# EAGLE design Pipe_flow_header_v3 (EAGLE 8.5.2)
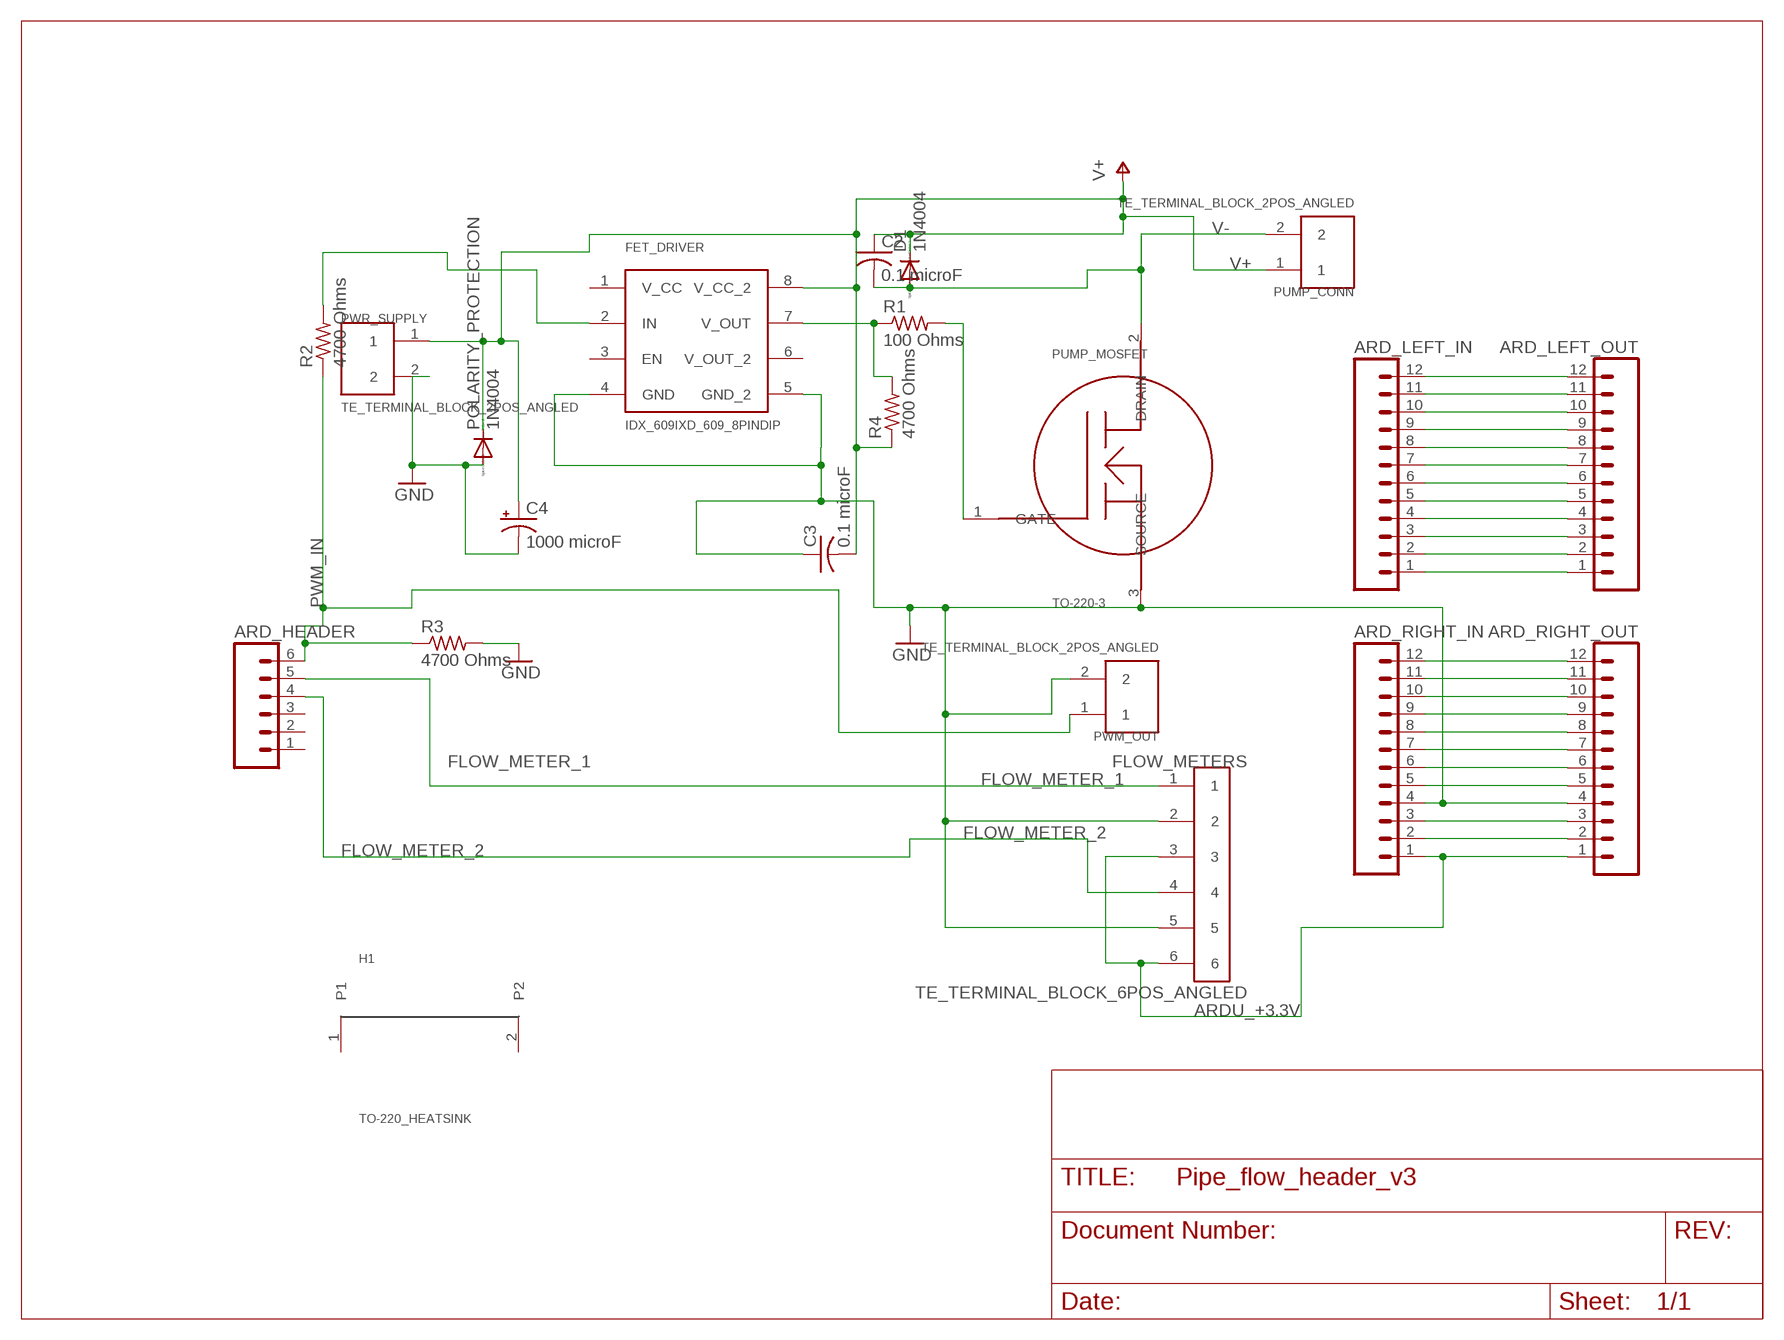
[diagram p0: schematic, sheet 1]

## Parts
ARD_HEADER  M06LONGPADS  [1X06_LONGPADS]
ARD_LEFT_IN  M12LOCK_LONGPADS  [1X12_LOCK_LONGPADS]
ARD_LEFT_OUT  M12LOCK_LONGPADS  [1X12_LOCK_LONGPADS]
ARD_RIGHT_IN  M12LOCK_LONGPADS  [1X12_LOCK_LONGPADS]
ARD_RIGHT_OUT  M12LOCK_LONGPADS  [1X12_LOCK_LONGPADS]
C2  0.1 microF  C-US075-032X103  [C075-032X103]
C3  0.1 microF  C-US075-032X103  [C075-032X103]
C4  1000 microF  CPOL-USE7.5-16  [E7,5-16]
D1  1N4004  [DO41-10]
FET_DRIVER  IDX_609IXD_609_8PINDIP  [IDX_609_8PINDIP]
FLOW_METERS  TE_TERMINAL_BLOCK_6POS_ANGLED  [TE_TERMINAL_BLOCK_6POS_ANGLED]
H1  TO-220_HEATSINK  [TO-220_HEATSINK]
POLARITY_PROTECTION  1N4004  [DO41-10]
PUMP_CONN  TE_TERMINAL_BLOCK_2POS_ANGLED  [TE_TERMINAL_BLOCK_2POS_ANGLED]
PUMP_MOSFET  TO-220-3  [TO-220-3]
PWM_OUT  TE_TERMINAL_BLOCK_2POS_ANGLED  [TE_TERMINAL_BLOCK_2POS_ANGLED]
PWR_SUPPLY  TE_TERMINAL_BLOCK_2POS_ANGLED  [TE_TERMINAL_BLOCK_2POS_ANGLED]
R1  100 Ohms  R-US_0204/7  [0204/7]
R2  4700 Ohms  R-US_0204/7  [0204/7]
R3  4700 Ohms  R-US_0204/7  [0204/7]
R4  4700 Ohms  R-US_0204/7  [0204/7]

## Nets
ARDU_+3.3V: ARD_RIGHT_IN.1 ARD_RIGHT_OUT.1 FLOW_METERS.3 FLOW_METERS.6
FLOW_METER_1: ARD_HEADER.5 FLOW_METERS.1
FLOW_METER_2: ARD_HEADER.4 FLOW_METERS.4
GATE: PUMP_MOSFET.1(GATE) R1.2
GND: ARD_RIGHT_IN.4 ARD_RIGHT_OUT.4 C3.1 C4.- FET_DRIVER.4(GND) FET_DRIVER.5(GND_2) FLOW_METERS.2 FLOW_METERS.5 POLARITY_PROTECTION.A PUMP_MOSFET.3(SOURCE) PWM_OUT.2 PWR_SUPPLY.2 R3.2
N$1: ARD_LEFT_IN.1 ARD_LEFT_OUT.1
N$2: ARD_LEFT_IN.2 ARD_LEFT_OUT.2
N$3: ARD_LEFT_IN.3 ARD_LEFT_OUT.3
N$4: ARD_LEFT_IN.12 ARD_LEFT_OUT.12
N$5: ARD_LEFT_IN.4 ARD_LEFT_OUT.4
N$6: ARD_LEFT_IN.5 ARD_LEFT_OUT.5
N$7: ARD_LEFT_IN.6 ARD_LEFT_OUT.6
N$8: ARD_LEFT_IN.7 ARD_LEFT_OUT.7
N$9: ARD_LEFT_IN.8 ARD_LEFT_OUT.8
N$10: ARD_LEFT_IN.9 ARD_LEFT_OUT.9
N$11: ARD_LEFT_IN.10 ARD_LEFT_OUT.10
N$12: ARD_LEFT_IN.11 ARD_LEFT_OUT.11
N$13: FET_DRIVER.7(V_OUT) R1.1 R4.2
N$14: FET_DRIVER.2(IN) R2.2
N$15: ARD_RIGHT_IN.2 ARD_RIGHT_OUT.2
N$16: ARD_RIGHT_IN.3 ARD_RIGHT_OUT.3
N$18: ARD_RIGHT_IN.5 ARD_RIGHT_OUT.5
N$19: ARD_RIGHT_IN.6 ARD_RIGHT_OUT.6
N$20: ARD_RIGHT_IN.7 ARD_RIGHT_OUT.7
N$21: ARD_RIGHT_IN.8 ARD_RIGHT_OUT.8
N$22: ARD_RIGHT_IN.9 ARD_RIGHT_OUT.9
N$23: ARD_RIGHT_IN.10 ARD_RIGHT_OUT.10
N$24: ARD_RIGHT_IN.11 ARD_RIGHT_OUT.11
N$25: ARD_RIGHT_IN.12 ARD_RIGHT_OUT.12
PWM_IN: ARD_HEADER.6 PWM_OUT.1 R2.1 R3.1
V+: C2.1 C3.2 C4.+ D1.C FET_DRIVER.8(V_CC_2) POLARITY_PROTECTION.C PUMP_CONN.1 PWR_SUPPLY.1 R4.1
V-: C2.2 D1.A PUMP_CONN.2 PUMP_MOSFET.2(DRAIN)
Unconnected: ARD_HEADER.1 ARD_HEADER.2 ARD_HEADER.3 FET_DRIVER.1(V_CC) FET_DRIVER.3(EN) FET_DRIVER.6(V_OUT_2) H1.1 H1.2

## Library data of the parts
ARD_HEADER = SparkFun-Connectors:M06: Header 6 Standard 6-pin 0.1" header. Use with straight break away headers (SKU : PRT-00116), right angle break away headers (PRT-00553), swiss pins (PRT-00743), machine pins (PRT-00117), and female headers (PRT-00115). Molex polarized connector foot print use with SKU : PRT-08094 with associated crimp pins and housings. NOTES ON THE VARIANTS LOCK and LOCK_LONGPADS... This footprint was designed to help hold the alignment of a through-hole component (i.e. 6-pin header) while soldering it into place. You may notice that each hole has been shifted either up or down by 0.005 of an inch from it's more standard position (which is a perfectly straight line). This slight alteration caused the pins (the squares in the middle) to touch the edges of the holes. Because they are alternating, it causes a "brace" to hold the component in place. 0.005 has proven to be the perfect amount of "off-center" position when using our standard breakaway headers. Although looks a little odd when you look at the bare footprint, once you have a header in there, the alteration is very hard to notice. Also,if you push a header all the way into place, it is covered up entirely on the bottom side. This idea of altering the position of holes to aid alignment will be further integrated into the Sparkfun Library for other footprints. It can help hold any component with 3 or more connection pins.
ARD_LEFT_IN ARD_LEFT_OUT ARD_RIGHT_IN ARD_RIGHT_OUT = SparkFun-Connectors:M12: Header 12 Standard 12-pin 0.1" header. Use with straight break away headers (SKU : PRT-00116), right angle break away headers (PRT-00553), swiss pins (PRT-00743), machine pins (PRT-00117), and female headers (PRT-00115).
C2 C3 = adafruit:C-US: CAPACITOR, American symbol
C4 = adafruit:CPOL-US: POLARIZED CAPACITOR, American symbol
D1 POLARITY_PROTECTION = diode:1N4004: DIODE general purpose rectifier, 1 A
FET_DRIVER = marks_parts_pton:IDX_609
FLOW_METERS = marks_parts_pton:TE_TERMINAL_BLOCK_6POS_ANGLED: TE Connectivity Terminal Block, 6 Position, 35 Degree Angle PN: 282847-6
H1 = marks_parts_pton:TO-220_HEATSINK: Extruded aluminum heatsink for TO-220 Transistor Package 533402B02552G
PUMP_CONN PWM_OUT PWR_SUPPLY = marks_parts_pton:TE_TERMINAL_BLOCK_2POS_ANGLED: TE Terminal Block, 2 Position with 35 degree angle PN: 282847-2
PUMP_MOSFET = marks_parts_pton:TO-220-3
R1-R4 = adafruit:R-US_: RESISTOR, American symbol

## Board
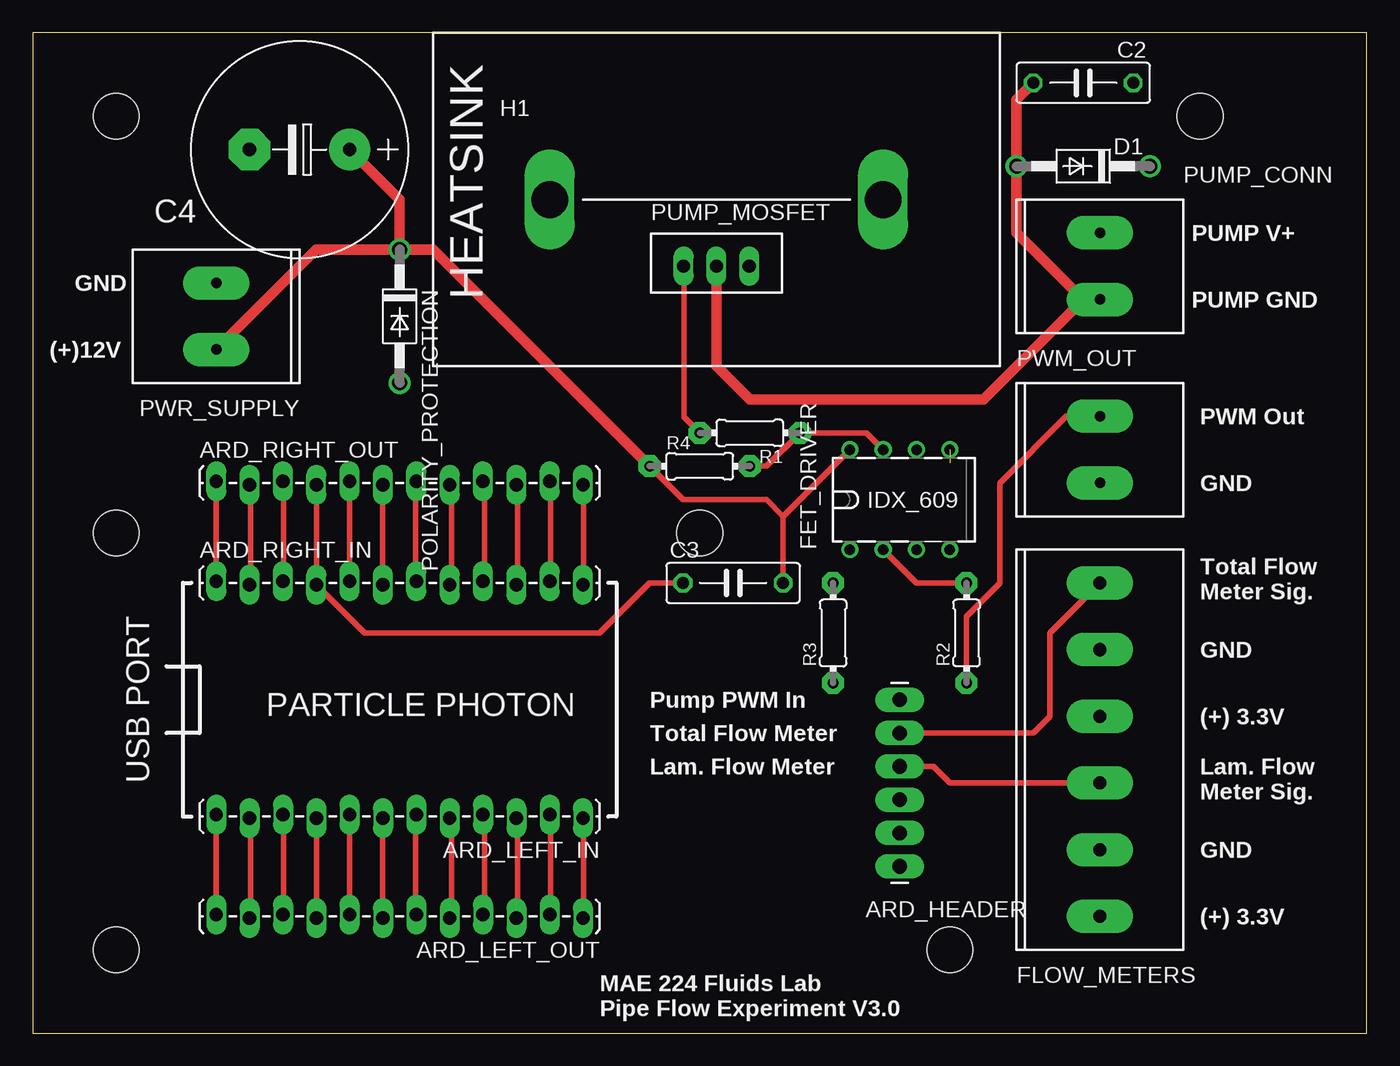
[diagram p1: board, top side]
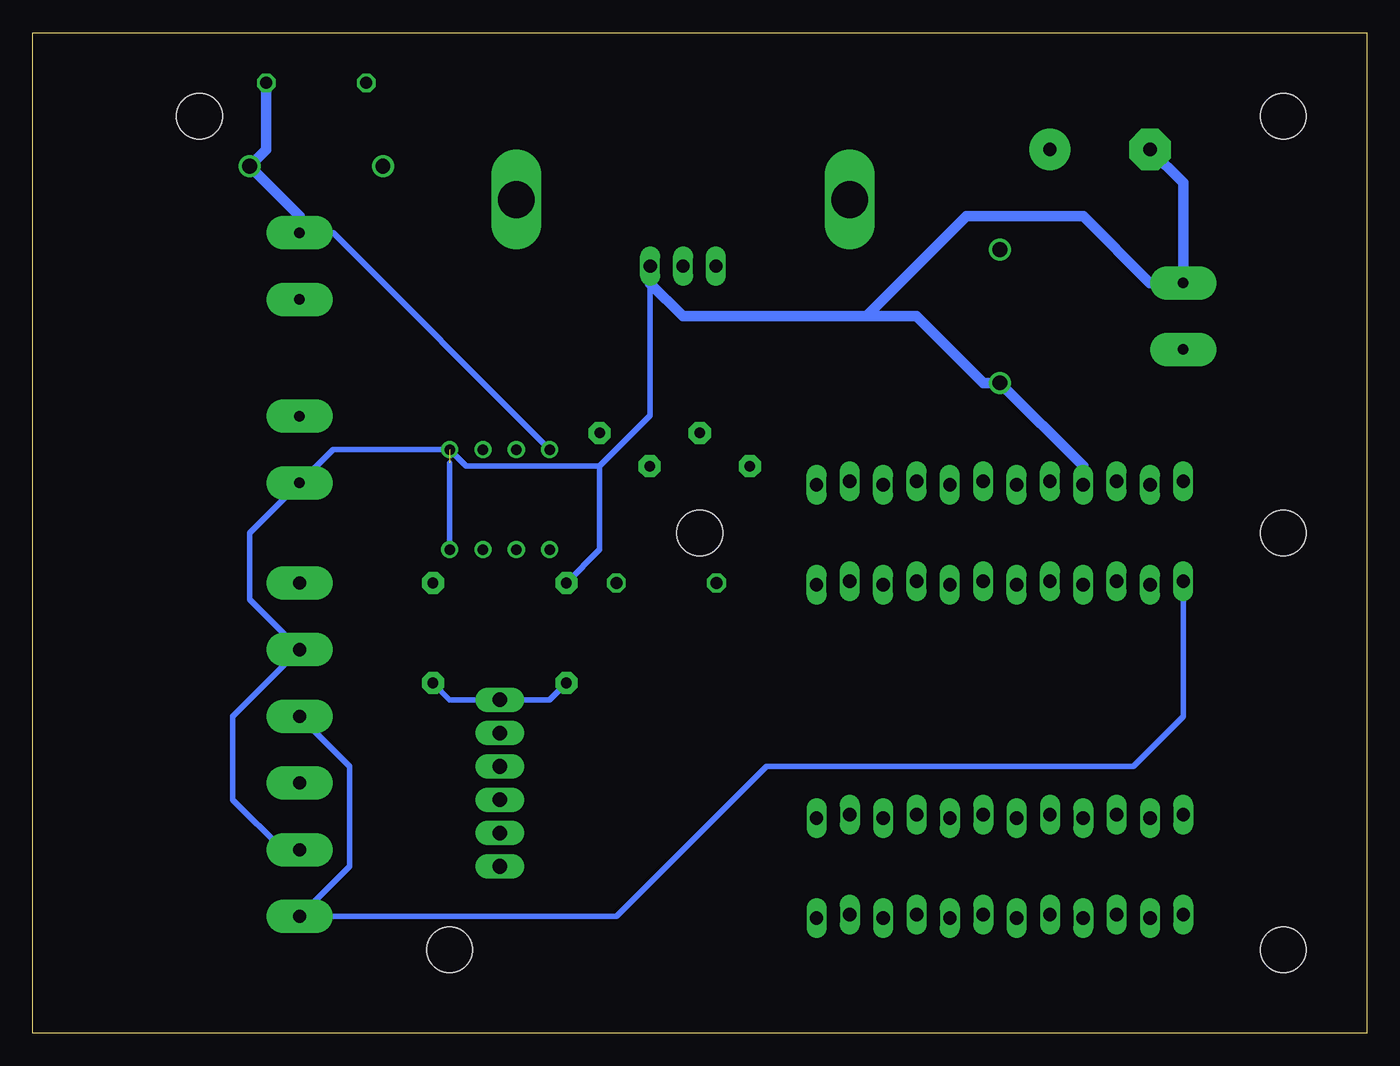
[diagram p2: board, bottom side, seen from below]

Size 101.6 x 76.2 mm. Coordinates in mm from the lower left corner, seen from the top.
Outline: 0,0 101.6,0 101.6,76.2 0,76.2 0,0
Copper layers (1*16): Top 0.0356mm / dielectric 1.5011mm / Bottom 0.0356mm
Design rules "SilverCircuits": minimum track width 7mil, minimum drill 14mil, track to track 7mil, track to pad 7mil, pad to pad 7mil, via to via 7mil, smd to smd 0mil, copper to edge 20mil, drill to drill 8mil, minimum pad ring 10mil, minimum via ring 8mil, stop-mask expansion 4mil, vias tented up to drill 0mil, thermal gap 10mil
Holes 3.51 mm at 6.35,69.85 6.35,6.35 69.85,6.35 88.9,69.85 50.8,38.1 6.35,38.1

### Footprints (pad centres in the part's own frame; a part is rotated, then mirrored left to right if it is on the bottom)
1X06_LONGPADS = drill 1.118 pad 1.88 long: 1 0,0; 2 2.54,0; 3 5.08,0; 4 7.62,0; 5 10.16,0; 6 12.7,0
1X12_LOCK_LONGPADS = drill 1.016 long: 1 0,0.127; 2 2.54,-0.127; 3 5.08,0.127; 4 7.62,-0.127; 5 10.16,0.127; 6 12.7,-0.127; 7 15.24,0.127; 8 17.78,-0.127; 9 20.32,0.127; 10 22.86,-0.127; 11 25.4,0.127; 12 27.94,-0.127
C075-032X103 = drill 0.914 octagon: 1 -3.81,0; 2 3.81,0
E7,5-16 = drill 1.016 pad 3.15: + -3.81,0 | drill 1.016 pad 3.15 octagon: - 3.81,0
DO41-10 = drill 1.118: A 5.08,0; C -5.08,0
IDX_609_8PINDIP = drill 0.8: 1 -3.81,0; 2 -3.81,-2.54; 3 -3.81,-5.08; 4 -3.81,-7.62; 5 3.81,-7.62; 6 3.81,-5.08; 7 3.81,-2.54; 8 3.81,0
TE_TERMINAL_BLOCK_6POS_ANGLED = drill 1 pad 2.54 long: 1 -12.7,0; 2 -7.62,0; 3 -2.54,0; 4 2.54,0; 5 7.62,0; 6 12.7,0
TO-220_HEATSINK = drill 2.8 long: 1 -12.7,0; 2 12.7,0
TE_TERMINAL_BLOCK_2POS_ANGLED = drill 0.8 pad 2.54 long: 1 0,2.54; 2 0,-2.54
TO-220-3 = drill 1 long: 1 -2.5,0; 2 0,0; 3 2.5,0
0204/7 = drill 0.813 pad 1.676 octagon: 1 -3.81,0; 2 3.81,0

### Placement (x,y rotation side)
ARD_HEADER  66.04,12.7 90 top
ARD_LEFT_IN  41.91,16.51 180 top
ARD_LEFT_OUT  41.91,8.89 180 top
ARD_RIGHT_IN  13.97,34.29 0 top
ARD_RIGHT_OUT  13.97,41.91 0 top
C2  80.01,72.39 180 top
C3  53.34,34.29 0 top
C4  20.32,67.31 180 top
D1  80.01,66.04 180 top
FET_DRIVER  62.23,40.64 90 top
FLOW_METERS  81.28,21.59 270 top
H1  52.07,63.5 0 top
POLARITY_PROTECTION  27.94,54.61 270 top
PUMP_CONN  81.28,58.42 0 top
PUMP_MOSFET  52.07,58.42 0 top
PWM_OUT  81.28,44.45 0 top
PWR_SUPPLY  13.97,54.61 180 top
R1  54.61,45.72 180 top
R2  71.12,30.48 90 top
R3  60.96,30.48 90 top
R4  50.8,43.18 0 top

### Tracks (layer width: path | path; a pad name or v marks a point on that pad's centre or on a via)
ARDU_+3.3V
  Top 0.406: ARD_RIGHT_OUT.1 ARD_RIGHT_IN.1
  Bottom 0.406: FLOW_METERS.3 77.47,20.32 77.47,12.7 FLOW_METERS.6 57.15,8.89 45.72,20.32 17.78,20.32 13.97,24.13 ARD_RIGHT_IN.1
FLOW_METER_1
  Top 0.406: FLOW_METERS.1 77.47,30.48 77.47,24.13 76.2,22.86 ARD_HEADER.5
FLOW_METER_2
  Top 0.406: FLOW_METERS.4 69.85,19.05 68.58,20.32 ARD_HEADER.4
GATE
  Top 0.254: 49.61,58.52 PUMP_MOSFET.1 | 49.61,49.53 49.61,49.45
  Top 0.406: 49.61,58.52 49.61,49.53 49.61,46.91 R1.2
GND  (1 unrouted)
  Top 0.254: 21.61,34.21 ARD_RIGHT_IN.4 | 21.61,41.76 ARD_RIGHT_OUT.4
  Top 0.406: 21.61,41.76 21.61,34.21 | C3.1 46.99,34.29 43.18,30.48 25.27,30.48 ARD_RIGHT_IN.4
  Bottom 0.406: PUMP_MOSFET.3 54.57,47.03 58.42,43.18 | 58.42,43.18 68.58,43.18 FET_DRIVER.5 78.74,44.45 PWM_OUT.2 85.09,38.1 85.09,33.02 FLOW_METERS.2 86.36,24.13 86.36,17.78 82.55,13.97 FLOW_METERS.5 | R3.2 58.42,36.83 58.42,43.18 | FET_DRIVER.4 69.85,43.41
  Bottom 0.813: 38.1,54.61 34.29,54.61 29.21,49.53 POLARITY_PROTECTION.A 21.59,43.18 ARD_RIGHT_OUT.4 | 38.1,54.61 52.07,54.61 54.57,57.11 PUMP_MOSFET.3 | C4.- 13.97,64.77 PWR_SUPPLY.2 16.51,57.15 21.59,62.23 30.48,62.23 38.1,54.61
N$1
  Top 0.254: 41.96,8.84 ARD_LEFT_OUT.1 | 41.96,16.38 ARD_LEFT_IN.1
  Top 0.406: 41.96,16.38 41.96,8.84
N$2
  Top 0.254: 39.45,9.07 ARD_LEFT_OUT.2 | 39.45,16.61 ARD_LEFT_IN.2
  Top 0.406: 39.45,16.61 39.45,9.07
N$3
  Top 0.254: 36.93,8.84 ARD_LEFT_OUT.3 | 36.93,16.38 ARD_LEFT_IN.3
  Top 0.406: 36.93,16.38 36.93,8.84
N$4
  Top 0.254: 14.07,9.07 ARD_LEFT_OUT.12
  Top 0.406: ARD_LEFT_IN.12 ARD_LEFT_OUT.12
N$5
  Top 0.254: 34.42,9.07 ARD_LEFT_OUT.4 | 34.42,16.61 ARD_LEFT_IN.4
  Top 0.406: 34.42,16.61 34.42,9.07
N$6
  Top 0.254: 31.9,8.84 ARD_LEFT_OUT.5 | 31.9,16.38 ARD_LEFT_IN.5
  Top 0.406: 31.9,16.38 31.9,8.84
N$7
  Top 0.254: 29.16,9.07 ARD_LEFT_OUT.6 | 29.16,16.61 ARD_LEFT_IN.6
  Top 0.406: 29.16,16.61 29.16,9.07
N$8
  Top 0.254: 26.64,8.84 ARD_LEFT_OUT.7 | 26.64,16.38 ARD_LEFT_IN.7
  Top 0.406: 26.64,16.38 26.64,8.84
N$9
  Top 0.406: ARD_LEFT_IN.8 ARD_LEFT_OUT.8
N$10
  Top 0.254: 21.61,8.84 ARD_LEFT_OUT.9 | 21.61,16.38 ARD_LEFT_IN.9
  Top 0.406: 21.61,16.38 21.61,8.84
N$11
  Top 0.254: 19.1,9.07 ARD_LEFT_OUT.10 | 19.1,16.61 ARD_LEFT_IN.10
  Top 0.406: 19.1,16.61 19.1,9.07
N$12
  Top 0.254: 16.59,8.84 ARD_LEFT_OUT.11 | 16.59,16.38 ARD_LEFT_IN.11
  Top 0.406: 16.59,16.38 16.59,8.84
N$13
  Top 0.406: R4.2 55.88,43.18 R1.1 63.5,45.72 FET_DRIVER.7
N$14
  Top 0.406: FET_DRIVER.2 67.31,34.29 R2.2
N$15
  Top 0.254: 16.59,34.21 ARD_RIGHT_IN.2 | 16.59,41.76 ARD_RIGHT_OUT.2
  Top 0.406: 16.59,41.76 16.59,34.21
N$16
  Top 0.254: 19.1,34.44 ARD_RIGHT_IN.3 | 19.1,41.99 ARD_RIGHT_OUT.3
  Top 0.406: 19.1,41.99 19.1,34.44
N$18
  Top 0.406: ARD_RIGHT_OUT.5 ARD_RIGHT_IN.5
N$19
  Top 0.254: 26.64,34.21 ARD_RIGHT_IN.6 | 26.64,41.76 ARD_RIGHT_OUT.6
  Top 0.406: 26.64,41.76 26.64,34.21
N$20
  Top 0.254: 29.16,34.44 ARD_RIGHT_IN.7 | 29.16,41.99 ARD_RIGHT_OUT.7
  Top 0.406: 29.16,41.99 29.16,34.44
N$21
  Top 0.254: 31.9,34.21 ARD_RIGHT_IN.8 | 31.9,41.76 ARD_RIGHT_OUT.8
  Top 0.406: 31.9,41.76 31.9,34.21
N$22
  Top 0.254: 34.42,34.44 ARD_RIGHT_IN.9 | 34.42,41.99 ARD_RIGHT_OUT.9
  Top 0.406: 34.42,41.99 34.42,34.44
N$23
  Top 0.254: 36.93,34.21 ARD_RIGHT_IN.10 | 36.93,41.76 ARD_RIGHT_OUT.10
  Top 0.406: 36.93,41.76 36.93,34.21
N$24
  Top 0.254: 39.45,34.44 ARD_RIGHT_IN.11 | 39.45,41.99 ARD_RIGHT_OUT.11
  Top 0.406: 39.45,41.99 39.45,34.44
N$25
  Top 0.254: 41.96,34.21 ARD_RIGHT_IN.12 | 41.96,41.76 ARD_RIGHT_OUT.12
  Top 0.406: 41.96,41.76 41.96,34.21
PWM_IN
  Top 0.406: R2.1 71.12,31.75 73.66,34.29 73.66,41.91 78.74,46.99 PWM_OUT.1
  Bottom 0.406: R3.1 62.23,25.4 ARD_HEADER.6 69.85,25.4 R2.1
V+
  Top 0.406: FET_DRIVER.8 57.15,39.37 | 57.15,39.37 C3.2 | R4.1 49.53,40.64 55.88,40.64 57.15,39.37
  Top 0.813: PWR_SUPPLY.1 21.59,59.69 POLARITY_PROTECTION.C | C4.+ 27.94,63.5 POLARITY_PROTECTION.C | R4.1 30.48,59.69 POLARITY_PROTECTION.C
  Bottom 0.406: PUMP_CONN.1 78.74,60.96 FET_DRIVER.8
  Bottom 0.813: PUMP_CONN.1 81.28,62.23 D1.C 83.82,67.31 C2.1 | POLARITY_PROTECTION.C 27.97,59.72
V-
  Top 0.813: PUMP_MOSFET.2 52.07,50.8 54.61,48.26 72.39,48.26 80.01,55.88 | 80.01,55.88 PUMP_CONN.2 | 80.01,55.88 74.93,60.96 D1.A 74.93,71.12 C2.2

### Text on the board
tPlace: PUMP V+ | GND | PUMP GND | (+)12V | PWM Out | GND | Total Flow / Meter Sig. | GND | Pump PWM In | PARTICLE PHOTON | (+) 3.3V | Total Flow Meter | Lam. Flow Meter | USB PORT | Lam. Flow / Meter Sig. | GND | (+) 3.3V | MAE 224 Fluids Lab / Pipe Flow Experiment V3.0